# Altium project Remote Power Enable (RPE).PrjPcb
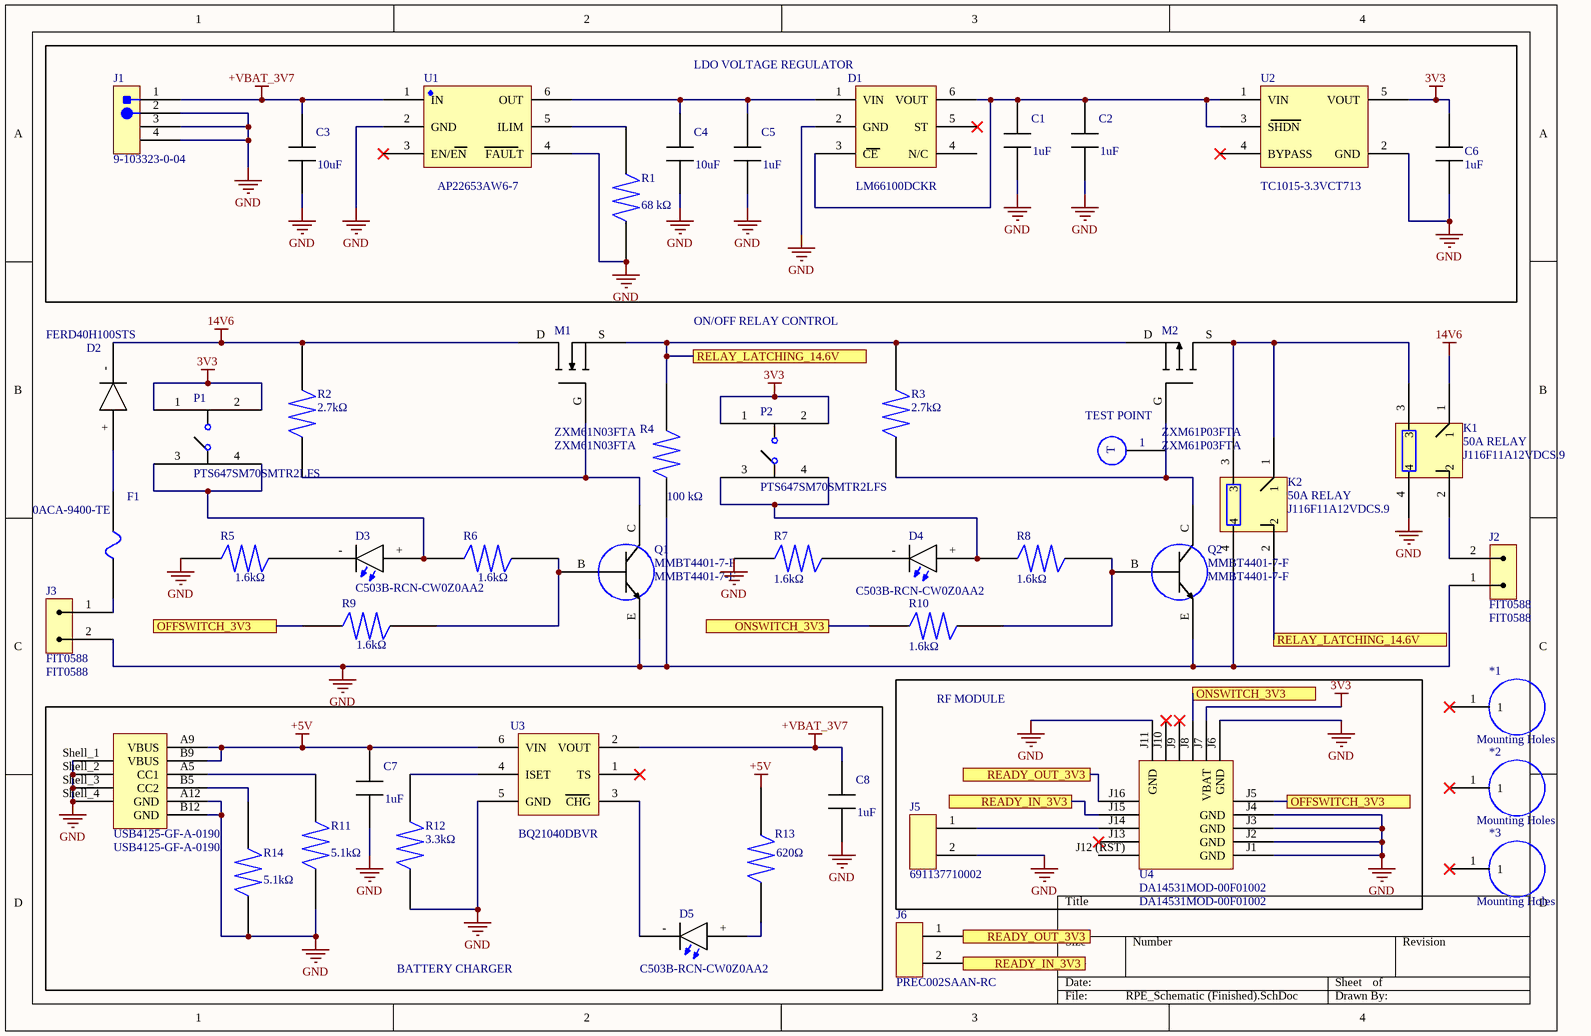
[diagram p0: RPE_Schematic (Finished).SchDoc]
1 sheet, 49 parts. Net scope: flat (ports and power ports of the same name join across sheets).
Board file: RPE_PCB.PcbDoc

## Sheet RPE_Schematic (Finished).SchDoc
size A4; SheetNumber: 1; SheetTotal: 1

### Parts
*1  Mounting Holes  [Mounting Holes]
*2  Mounting Holes  [Mounting Holes]
*3  Mounting Holes  [Mounting Holes]
C1  value 1uF  [CL10B105MO8NNWC]  (hidden comment: 1 uF Capacitor)
C2  value 1uF  [CL10B105MO8NNWC]  (hidden comment: 1 uF Capacitor)
C3  value 10uF  [GRM188D71A106MA73J]  (hidden comment: GRM188D71A106MA73J)
C4  value 10uF  [GRM188D71A106MA73J]  (hidden comment: GRM188D71A106MA73J)
C5  value 1uF  [CL10B105MO8NNWC]  (hidden comment: 1 uF Capacitor)
C6  value 1uF  [CL10B105MO8NNWC]  (hidden comment: 1 uF Capacitor)
C7  value 1uF  [CL10B105MO8NNWC]  (hidden comment: 1 uF Capacitor)
C8  value 1uF  [CL10B105MO8NNWC]  (hidden comment: 1 uF Capacitor)
D1  *  [LM66100DCKR]  (value not drawn)
D2  100V DIODE  [FERD40H100STS]  (value not drawn)
D3  RED THROUGH HOLE LED  [C503B-RCN-CW0Z0AA2]  (value not drawn)
D4  RED THROUGH HOLE LED  [C503B-RCN-CW0Z0AA2]  (value not drawn)
D5  RED THROUGH HOLE LED  [C503B-RCN-CW0Z0AA2]  (value not drawn)
F1  40A FUSE  [0ACA-9400-TE]  (value not drawn)
J1  9-103323-0-04  [9-103323-0-04]
J2  FIT0588  [FIT0588]
J3  FIT0588  [FIT0588]
J4  USB4125-GF-A-0190  [USB4125-GF-A]
J5  691137710002  [691137710002]
J6  PREC002SAAN-RC  [PREC002SAAN-RC]
K1  50A RELAY  [J116F11A12VDCS.9]
K2  50A RELAY  [J116F11A12VDCS.9]
M1  ZXM61N03FTA  [ZXM61N03FTA]
M2  ZXM61P03FTA  [ZXM61P03FTA]
P1  *  [PTS 647 SK50 SMTR2 LFS]  (value not drawn)
P2  *  [PTS 647 SK50 SMTR2 LFS]  (value not drawn)
Q1  MMBT4401-7-F  [MMBT4401-13-F]
Q2  MMBT4401-7-F  [MMBT4401-13-F]
R1  value 68 kΩ  [RMCF0603FT68K0]  (hidden comment: RMCF0603FT68K0)
R2  value 2.7kΩ  [CR0603-FX-2701ELF]  (hidden comment: CR0603-FX-2701ELF)
R3  value 2.7kΩ  [CR0603-FX-2701ELF]  (hidden comment: CR0603-FX-2701ELF)
R4  100 kΩ  [CR0603FB100KS1]
R5  value 1.6kΩ  [SG73P1JTTD1601F]  (hidden comment: SG73P1JTTD1601F)
R6  value 1.6kΩ  [SG73P1JTTD1601F]  (hidden comment: SG73P1JTTD1601F)
R7  value 1.6kΩ  [SG73P1JTTD1601F]  (hidden comment: SG73P1JTTD1601F)
R8  value 1.6kΩ  [SG73P1JTTD1601F]  (hidden comment: SG73P1JTTD1601F)
R9  value 1.6kΩ  [SG73P1JTTD1601F]  (hidden comment: SG73P1JTTD1601F)
R10  value 1.6kΩ  [SG73P1JTTD1601F]  (hidden comment: SG73P1JTTD1601F)
R11  value 5.1kΩ  [RC0603FR-075K1L]  (hidden comment: RC0603FR-075K1L)
R12  value 3.3kΩ  [RC0603JR-133K3L]  (hidden comment: Chip Resistor)
R13  value 620Ω  [RMCF0603FT620R]  (hidden comment: RMCF0603FT620R)
R14  value 5.1kΩ  [RC0603FR-075K1L]  (hidden comment: RC0603FR-075K1L)
U1  *  [AP22653AW6-7]  (value not drawn)
U2  *  [TC1015-3.3VCT713]  (value not drawn)
U3  BQ21040DBVR  [BQ21040DBVR]
U4  DA14531MOD-00F01002  [DA14531MOD_REN]

### Blocks framed on the sheet
LDO VOLTAGE REGULATOR: C1-C6 D1 J1 R1 U1 U2
BATTERY CHARGER: C7 C8 D5 J4 R11-R14 U3
RF MODULE: J5 U4

### Ports
OFFSWITCH_3V3, ONSWITCH_3V3, READY_IN_3V3, READY_OUT_3V3, RELAY_LATCHING_14.6V

### Nets
3V3: C6.2 P1.1 P1.2 P2.1 P2.2 U2.5(VOUT) U4.J7(VBAT)
14V6: D2.- K1.1 M1.D R2.2
+5V: C7.2 J4.A9(VBUS) J4.B9(VBUS) R13.2 U3.6(VIN)
+VBAT_3V7: C3.2 C8.2 J1.1 U1.1(IN) U3.2(VOUT)
GND: C1.1 C2.1 C3.1 C4.1 C5.1 C6.1 C7.1 C8.1 D1.2(GND) J1.2 J1.3 J1.4 J2.1 J3.2 J4.A12(GND) J4.B12(GND) J4.Shell_1 J4.Shell_2 J4.Shell_3 J4.Shell_4 J5.2 K1.4 K2.4 Q1.E Q2.E R1.1 R4.1 R5.1 R7.1 R11.1 R12.1 R14.1 U1.2(GND) U1.4(FAULT) U2.2(GND) U3.5(GND) U4.J1(GND) U4.J2(GND) U4.J3(GND) U4.J4(GND) U4.J6(GND) U4.J11(GND)
NetC1_2: C1.2 C2.2 D1.3(CE) D1.6(VOUT) U2.1(VIN) U2.3(SHDN)
NetC4_2: C4.2 C5.2 D1.1(VIN) U1.6(OUT)
NetD2_+: D2.+ F1.1
NetD3_+: D3.+ P1.3 P1.4 R6.1
NetD3_-: D3.- R5.2
NetD4_+: D4.+ P2.3 P2.4 R8.1
NetD4_-: D4.- R7.2
NetD5_+: D5.+ R13.1
NetD5_-: D5.- U3.3(CHG)
NetF1_2: F1.2 J3.1
NetJ2_2: J2.2 K1.2
NetJ4_A5: J4.A5(CC1) R11.2
NetJ4_B5: J4.B5(CC2) R14.2
NetJ5_1: J5.1 U4.J14
NetJ6_1: J6.1 U4.J16 ; port READY_OUT_3V3
NetJ6_2: J6.2 U4.J15 ; port READY_IN_3V3
NetK1_3: K1.3 K2.1 K2.3 M2.S
NetK2_2: K2.2 M1.S M2.D R3.2 R4.2 ; port RELAY_LATCHING_14.6V
NetM1_G: M1.G Q1.C R2.1
NetM2_G: M2.G Q2.C R3.1
NetQ1_B: Q1.B R6.2 R9.2
NetQ2_B: Q2.B R8.2 R10.2
NetR1_2: R1.2 U1.5(ILIM)
NetR9_1: R9.1 U4.J5 ; port OFFSWITCH_3V3
NetR10_1: R10.1 U4.J8 ; port ONSWITCH_3V3
NetR12_2: R12.2 U3.4(ISET)

Not connected (* = marked no-connect by the designer): *1 1*; *2 1*; *3 1*; D1 4(N/C) 5(ST)*; U1 3(EN/EN)*; U2 4(BYPASS)*; U3 1(TS)*; U4 J9* J10* J12 (RST) J13*

### Notes on the sheet
- ON/OFF RELAY CONTROL
- (near M2) TEST POINT
- T
- 1

### Library data of the parts
C1 C2 C5-C8 = CL10B105MO8NNWC: SMD Multilayer Ceramic Capacitor, 1 µF, 16 V, 0603 [1608 Metric], ± 20%, X7R, CL Series; Manufacturer: Samsung; Material: 4241ConductorMaterial; Voltage Rating: 16V; Dielectric: 1511DielectricType; Supplier: Digikey; Supplier Part Number: 1276-6524-1-ND; Manufacturer Part Number: CL10B105MO8NNWC; RoHS: Yes; Category: Ceramic Capacitors; Stock: 1284189; Pricing: 1=0.1, 10=0.034, 50=0.0196, 100=0.0152, 500=0.01142, 1000=0.00897 (USD); Mounting Technology: Surface Mount; Case/Package: 0603; Case Code (Metric): 1608; Case Code (Imperial): 0603; Min Operating Temperature: -55°C; Max Operating Temperature: 125°C; Packaging: Cut Tape; Tolerance: 20%; Series: CL; Voltage Rating (DC): 16V; Length: 0.063inch; Width: 0.031inch; Height: 900um; Thickness: 0.035inch; RoHS Compliant: Yes; ComponentLink1URL: https://media.digikey.com/pdf/Data%20Sheets/Samsung%20PDFs/CL10B105MO8NNWC.pdf?src-supplier=Digikey; ComponentLink1Description: https://media.digikey.com/pdf/Data%20Sheets/Samsung%20PDFs/CL10B105MO8NNWC.pdf?src-supplier=Digikey; ComponentLink2URL: http://www.farnell.com/datasheets/2710574.pdf?src-supplier=Farnell; ComponentLink2Description: http://www.farnell.com/datasheets/2710574.pdf?src-supplier=Farnell; ComponentLink3URL: https://datasheet.octopart.com/CL10B105MO8NNWC-Samsung-Electro-Mechanics-datasheet-120079234.pdf?src-supplier=Future+Electronics; ComponentLink3Description: https://datasheet.octopart.com/CL10B105MO8NNWC-Samsung-Electro-Mechanics-datasheet-120079234.pdf?src-supplier=Future+Electronics; ComponentLink4URL: http://www.farnell.com/datasheets/2710574.pdf?src-supplier=Newark; ComponentLink4Description: http://www.farnell.com/datasheets/2710574.pdf?src-supplier=Newark; ComponentLink5URL: http://www.farnell.com/datasheets/2710574.pdf?src-supplier=Element14; ComponentLink5Description: http://www.farnell.com/datasheets/2710574.pdf?src-supplier=Element14
C3 C4 = GRM188D71A106MA73J: Cap 10UF 10VDC X7T 20% SMD 0603 Paper Tape; Manufacturer: Murata; Voltage Rating: 10V; Supplier: Digikey; Supplier Part Number: 490-GRM188D71A106MA73JCT-ND; Manufacturer Part Number: GRM188D71A106MA73J; RoHS: Yes; Category: Ceramic Capacitors; Stock: 9799; Pricing: 1=0.3, 10=0.197, 50=0.145, 100=0.118, 500=0.09316, 1000=0.07867, 2500=0.07453, 5000=0.07039 (USD); Mounting Technology: Surface Mount; Case/Package: 0603; Weight: 0.000222oz; Min Operating Temperature: -55°C; Max Operating Temperature: 125°C; Packaging: Tape and Reel; Tolerance: 20%; Package Quantity: 10000; Dielectric: X7T; Voltage Rating (DC): 10V; Series: GRM; RoHS Compliant: Yes; ComponentLink1URL: http://www.mouser.com/ds/2/281/c02e-2905.pdf?src-supplier=Mouser; ComponentLink1Description: http://www.mouser.com/ds/2/281/c02e-2905.pdf?src-supplier=Mouser; ComponentLink2URL: http://search.murata.co.jp/Ceramy/image/img/A01X/partnumbering_e_01.pdf?src-supplier=Digikey; ComponentLink2Description: http://search.murata.co.jp/Ceramy/image/img/A01X/partnumbering_e_01.pdf?src-supplier=Digikey
D1 = LM66100DCKR: 1.5-V to 5.5-V, 1.5-A, 0.5-uA IQ ideal diode with Integrated FET 6-SC70 -40 to 105; Manufacturer: Texas Instruments; Max Output current: 1.5A; Turn-On Delay Time: 27us; Turn-Off Delay Time: 2us; Supplier: Digikey; Supplier Part Number: 296-53541-1-ND; RoHS: Yes; Category: Integrated Circuits (ICs); Stock: 1921; Pricing: 1=0.41, 10=0.332, 25=0.304, 100=0.2262, 250=0.20504, 500=0.16968, 1000=0.12726 (USD); Mounting Technology: Surface Mount; Min Operating Temperature: -40°C; Max Operating Temperature: 105°C; Series: -; ComponentLink1URL: http://www.ti.com/general/docs/suppproductinfo.tsp?distId=10&amp;gotoUrl=http%3A%2F%2Fwww.ti.com%2Flit%2Fgpn%2flm66100&src-supplier=Digikey; ComponentLink1Description: http://www.ti.com/general/docs/suppproductinfo.tsp?distId=10&amp;gotoUrl=http%3A%2F%2Fwww.ti.com%2Flit%2Fgpn%2flm66100&src-supplier=Digikey; Manufacturer Part Number: LM66100DCKR
D2 = FERD40H100STS: FERD40H100 Series 100 V 40 A Field Effect Rectifier Diode - TO-220AB; Manufacturer: STMicroelectronics; Average Rectified Current: 40A; Supplier: Digikey; Supplier Part Number: 497-16954-ND; RoHS: Yes; Category: Rectifier Diodes; Stock: 1657; Pricing: 1=1.4, 50=1.1266, 100=0.8927, 500=0.7567, 1000=0.61641, 2000=0.58028, 5000=0.55264, 10000=0.52714 (USD); Mounting Technology: Through Hole; Case/Package: TO-220-3; Packaging: Rail/Tube; Max Reverse Voltage (DC): 100V; Series: -; Diode Type: RECTIFIER; RoHS Compliant: Yes; ComponentLink1URL: http://www.st.com/content/ccc/resource/technical/document/datasheet/group3/4e/b5/b8/47/b6/af/41/d6/DM00281757/files/DM00281757.pdf/jcr:content/translations/en.DM00281757.pdf?src-supplier=Digikey; ComponentLink1Description: http://www.st.com/content/ccc/resource/technical/document/datasheet/group3/4e/b5/b8/47/b6/af/41/d6/DM00281757/files/DM00281757.pdf/jcr:content/translations/en.DM00281757.pdf?src-supplier=Digikey; ComponentLink2URL: https://datasheet.octopart.com/FERD40H100STS-STMicroelectronics-datasheet-62332851.pdf?src-supplier=Future+Electronics; ComponentLink2Description: https://datasheet.octopart.com/FERD40H100STS-STMicroelectronics-datasheet-62332851.pdf?src-supplier=Future+Electronics; ComponentLink3URL: https://datasheet.octopart.com/FERD40H100STS-STMicroelectronics-datasheet-141402762.pdf?src-supplier=TME; ComponentLink3Description: https://datasheet.octopart.com/FERD40H100STS-STMicroelectronics-datasheet-141402762.pdf?src-supplier=TME; Manufacturer Part Number: FERD40H100STS
D3-D5 = C503B-RCN-CW0Z0AA2: CREE - C503B-RCN-CW0Z0AA2 - LED, Red, Through Hole, T-1 3/4 (5mm), 20 mA, 2.1 V, 624 nm; Lens Color: Colorless; Luminous Intensity: 7500mcd; Viewing Angle: 30°; Forward Voltage: 2.1V; Wavelength: 624nm; Forward Current: 20mA; Lens Style: Dome,Elliptical,Round; Lens Transparency: Clear; Number of LEDs: 1; Supplier: Digikey; Supplier Part Number: C503B-RCN-CW0Z0AA2CT-ND; Manufacturer: Cree; RoHS: Yes; Category: LEDs; Stock: 49819; Pricing: 1=0.18, 10=0.167, 100=0.1548, 1000=0.139 (USD); Mounting Technology: Through Hole; Case/Package: Radial; Pins: 5; Color: Red; Min Operating Temperature: -40°C; Max Operating Temperature: 100°C; Illumination Color: Red; Package Quantity: 2500; Packaging: Cut Tape; Test Current: 20mA; Dominant Wavelength: 624nm; Series: -; Height: 10.3mm; RoHS Compliant: Yes; Reach SVHC Compliant: Unknown; ComponentLink1URL: https://datasheet.ciiva.com/8076/c503brasranaasaanrbsrbnabsabnrcsrcnacsacn1079-8076255.pdf?src-supplier=Element14; ComponentLink1Description: https://datasheet.ciiva.com/8076/c503brasranaasaanrbsrbnabsabnrcsrcnacsacn1079-8076255.pdf?src-supplier=Element14; ComponentLink2URL: https://datasheet.ciiva.com/46396/1783695-46396283.pdf?src-supplier=Element14; ComponentLink2Description: https://datasheet.ciiva.com/46396/1783695-46396283.pdf?src-supplier=Element14; ComponentLink3URL: https://datasheet.ciiva.com/2116/c503brasranaasaanrbsrbnabsabnrcsrcnacsacn1079-2116093.pdf?src-supplier=Digikey; ComponentLink3Description: https://datasheet.ciiva.com/2116/c503brasranaasaanrbsrbnabsabnrcsrcnacsacn1079-2116093.pdf?src-supplier=Digikey; Manufacturer Part Number: C503B-RCN-CW0Z0AA2
F1 = 0ACA-9400-TE: Bel Fuse, Internal Part #: 0ACA-9400-TE 40A FUSE; Supplier: Digikey; Supplier Part Number: 507-0ACA-9400-TECT-ND; Manufacturer: Bel; RoHS: Yes; Category: Fuses; Stock: 695; Pricing: 1=1.32, 5=1.282, 10=1.199, 50=0.9926, 100=0.8272, 250=0.80652, 500=0.68244 (USD); Manufacturer Part Number: 0ACA-9400-TE
J1 = 9-103323-0-04: CONN HEADR BRKWAY .100 04POS R/A 4 PIN HEADER; Manufacturer: TE Connectivity; Number of Positions: 4; Gender: Male; Supplier: Digikey; Supplier Part Number: A32705-04-ND; RoHS: Yes; Category: Connectors; Stock: 9773; Pricing: 1=0.69, 10=0.672, 100=0.5422, 500=0.4801, 1000=0.4208, 5000=0.36714, 10000=0.34172 (USD); Mounting Technology: Through Hole; Case/Package: 100; Housing Color: Black; Contact Material: Copper Alloy; Housing Material: Plastic; Contact Shape: Square; Contact Finish - Mating: TIN; Insulation Material: Thermoplastic; Insulation Color: Black; Min Operating Temperature: -65°C; Max Operating Temperature: 105°C; Number of Rows: 1; Packaging: Bulk; Termination: Solder; Number of Contacts: 4; Series: AMPMODU MOD II; Contact Type: Male Pin; Fastening Type: Pull; Length: 9.75mm; Width: 2.29mm; Height: 3.5mm; Lead Free: Lead Free; Flammability Rating: UL94 V-0; ComponentLink1URL: http://www.te.com/commerce/DocumentDelivery/DDEController?Action=srchrtrv&DocNm=103323&DocType=Customer+Drawing&DocLang=English&src-supplier=Digikey; ComponentLink1Description: http://www.te.com/commerce/DocumentDelivery/DDEController?Action=srchrtrv&DocNm=103323&DocType=Customer+Drawing&DocLang=English&src-supplier=Digikey; Manufacturer Part Number: 9-103323-0-04
J2 J3 = FIT0588: High Quality Gold Plated Male and Female Bullet Connector; Manufacturer: DFRobot; Supplier: Digikey; Supplier Part Number: 1738-1438-ND; RoHS: No; Category: LDO; Stock: 1280; Pricing: 1=3.9 (USD); ComponentLink1URL: https://media.digikey.com/pdf/Data%20Sheets/DFRobot%20PDFs/FIT0588_Web.pdf?src-supplier=Digikey; ComponentLink1Description: https://media.digikey.com/pdf/Data%20Sheets/DFRobot%20PDFs/FIT0588_Web.pdf?src-supplier=Digikey; Manufacturer Part Number: FIT0588
J4 = USB4125-GF-A-0190: USB Connector, 24 Contact(s), Female, Right Angle, Solder Terminal, Locking, Receptacle; Manufacturer: Global Connector Technology; USB Standard: 6108USBStandard; Current Rating: 3A; Number of Contacts: 6NUMBER; Voltage Rating: 20V; Supplier: Newark; Supplier Part Number: 56AJ0230; RoHS: No; Category: USB Connectors; Stock: 2157; Pricing: 1=0.379, 50=0.379, 100=0.347, 250=0.347, 500=0.32, 1000=0.32, 1500=0.32, 3000=0.298 (USD); Contact Material: 157ConductorMaterial; Min Operating Temperature: -30°C; Max Operating Temperature: 85°C; Height: 3.41mm; Manufacturer Part Number: USB4125-GF-A-0190
J5 = 691137710002: Series 1377 - 5.00 mm Horizontal Entry with Pressure Clamp WR-TBL, 2 pin; Manufacturer: Wurth Electronics; Plating: Copper Alloy,ZINC PLATED; Number of Levels: 1; Number of Positions Per Level: 2; Current: 16A; Voltage: 300V; Number of Contacts: 2NUMBER; Wire Gauge (Max): 30AWG; Wire Gauge (Min): 12AWG; Supplier: Digikey; Supplier Part Number: 732-10955-ND; RoHS: Yes; Category: Terminal Blocks; Stock: 5754; Pricing: 1=0.41, 10=0.363, 50=0.32, 100=0.287, 500=0.277 (USD); Mounting Technology: Through Hole; Pins: 2NUMBER; Color: Green; Housing Material: PC; Contact Material: 153,154ConductorMaterial; Min Operating Temperature: -30°C; Max Operating Temperature: 120°C; Termination: Screw; Series: WR-TBL Series 1377; Current Rating: 16A; Number of Rows: 1NUMBER; Voltage Rating: 300V; Height: 11.6mm; Lead Pitch: 5mm; RoHS Compliant: Yes; ComponentLink1URL: https://katalog.we-online.de/em/datasheet/691137710002.pdf?src-supplier=Digikey; ComponentLink1Description: https://katalog.we-online.de/em/datasheet/691137710002.pdf?src-supplier=Digikey; Manufacturer Part Number: 691137710002
J6 = PREC002SAAN-RC: CONN HEADER VERT 2POS 2.54MM
K1 K2 = J116F11A12VDCS.9: Relay Gen Purpose SPST 50A 12V; Manufacturer: CIT Relay & Switch; Supplier: Digikey; Supplier Part Number: 2449-J116F11A12VDCS.9-ND; RoHS: No; Category: Power Relays; Stock: 434; Pricing: 1=3.35, 15=3.136, 30=2.78767, 60=2.64817, 105=2.50886, 255=2.23008, 510=2.09071, 1005=1.95132, 5010=1.88163 (USD); Manufacturer Part Number: J116F11A12VDCS.9
M1 = ZXM61N03FTA: N-Channel 30V 1.4A (Ta) 625mW (Ta) Surface Mount SOT-23-3; Manufacturer: Diodes Zetex; Rise Time: 2.5ns; Gate to Source Voltage (Vgs): 20V; Turn-Off Delay Time: 5.8ns; Turn-On Delay Time: 1.9ns; Rds On Max: 220mR; Input Capacitance: 150pF; Nominal Vgs: 1V; Number of Elements: 1; Power Dissipation: 806mW; Current Rating: 1.2A; Supplier: Digikey; Supplier Part Number: ZXM61N03FCT-ND; RoHS: Yes; Category: MOSFETs; Stock: 146742; Pricing: 1=0.46, 10=0.397, 100=0.2757, 500=0.21528, 1000=0.17498 (USD); Mounting Technology: Surface Mount; Case/Package: SOT-23; Pins: 3; Weight: 0.000282oz; Min Operating Temperature: -55°C; Max Operating Temperature: 150°C; Fall Time: 2.5ns; Package Quantity: 3000; Packaging: Tape and Reel; Max Power Dissipation: 625mW; Dual Supply Voltage: 30V; Drain to Source Voltage (Vdss): 30V; Continuous Drain Current (ID): 1.4A; Number of Channels: 1; Drain to Source Resistance: 220mR; Termination: SMD/SMT; Voltage Rating (DC): 30V; Polarity: N-CHANNEL; Series: -; Drain-source On Resistance-Max: 220mR; Length: 3.04mm; Width: 1.4mm; Height: 1.02mm; Radiation Hardening: No; Reach SVHC Compliant: No; Lead Free: Lead Free; RoHS Compliant: Yes; ComponentLink1URL: https://datasheet.ciiva.com/11176/zxm61n03f-11176547.pdf?src-supplier=Avnet; ComponentLink1Description: https://datasheet.ciiva.com/11176/zxm61n03f-11176547.pdf?src-supplier=Avnet; ComponentLink2URL: https://datasheet.ciiva.com/935/zxm61n03f-935122.pdf?src-supplier=Digikey; ComponentLink2Description: https://datasheet.ciiva.com/935/zxm61n03f-935122.pdf?src-supplier=Digikey; ComponentLink3URL: https://datasheet.ciiva.com/5775/1643170-5775147.pdf?src-supplier=Farnell; ComponentLink3Description: https://datasheet.ciiva.com/5775/1643170-5775147.pdf?src-supplier=Farnell; ComponentLink4URL: https://datasheet.ciiva.com/935/zxm61n03f-935123.pdf?src-supplier=Digikey; ComponentLink4Description: https://datasheet.ciiva.com/935/zxm61n03f-935123.pdf?src-supplier=Digikey; ComponentLink5URL: https://datasheet.ciiva.com/935/zxm61n03f-935124.pdf?src-supplier=Digikey; ComponentLink5Description: https://datasheet.ciiva.com/935/zxm61n03f-935124.pdf?src-supplier=Digikey; ComponentLink6URL: https://datasheet.ciiva.com/8024/1643170-8024088.pdf?src-supplier=Element14; ComponentLink6Description: https://datasheet.ciiva.com/8024/1643170-8024088.pdf?src-supplier=Element14; Manufacturer Part Number: ZXM61N03FTA
M2 = ZXM61P03FTA: ZXM61P03F 30 V 0.35 Ohm P-Channel Enhancement Mode Vertical DMOS FET - SOT-23; Manufacturer: Diodes Zetex; Rise Time: 2.9ns; Gate to Source Voltage (Vgs): 20V; Turn-Off Delay Time: 8.9ns; Turn-On Delay Time: 1.9ns; Nominal Vgs: -1V; Max Power Dissipation: 625mW; Rds On Max: 350mR; Input Capacitance: 140pF; Number of Elements: 1; Dual Supply Voltage: -30V; Drain to Source Voltage (Vdss): 30V; Continuous Drain Current (ID): 1.1A; Drain to Source Resistance: 550mR; Power Dissipation: 806mW; Current Rating: -1.1A; Supplier: Digikey; Supplier Part Number: ZXM61P03FCT-ND; RoHS: Yes; Category: MOSFETs; Stock: 104868; Pricing: 1=0.42, 10=0.357, 100=0.2482, 500=0.19376, 1000=0.15748 (USD); Mounting Technology: Surface Mount; Case/Package: SOT-23; Pins: 3; Weight: 0.000282oz; Min Operating Temperature: -55°C; Max Operating Temperature: 150°C; Fall Time: 2.9ns; Packaging: Tape and Reel; Package Quantity: 3000; Number of Channels: 1; Termination: SMD/SMT; Voltage Rating (DC): -30V; Polarity: P-CHANNEL; Series: -; Drain-source On Resistance-Max: 350mR; Length: 3.04mm; Width: 1.4mm; Height: 1.02mm; Radiation Hardening: No; Reach SVHC Compliant: No; Lead Free: Lead Free; RoHS Compliant: Yes; ComponentLink1URL: https://datasheet.ciiva.com/11176/zxm61p03f-11176401.pdf?src-supplier=Avnet; ComponentLink1Description: https://datasheet.ciiva.com/11176/zxm61p03f-11176401.pdf?src-supplier=Avnet; ComponentLink2URL: https://datasheet.ciiva.com/11176/zxm61p03f-11176557.pdf?src-supplier=Avnet; ComponentLink2Description: https://datasheet.ciiva.com/11176/zxm61p03f-11176557.pdf?src-supplier=Avnet; ComponentLink3URL: https://datasheet.ciiva.com/935/zxm61p03f-935140.pdf?src-supplier=Digikey; ComponentLink3Description: https://datasheet.ciiva.com/935/zxm61p03f-935140.pdf?src-supplier=Digikey; ComponentLink4URL: https://datasheet.ciiva.com/935/zxm61p03f-935141.pdf?src-supplier=Digikey; ComponentLink4Description: https://datasheet.ciiva.com/935/zxm61p03f-935141.pdf?src-supplier=Digikey; ComponentLink5URL: https://datasheet.ciiva.com/935/zxm61p03f-935142.pdf?src-supplier=Digikey; ComponentLink5Description: https://datasheet.ciiva.com/935/zxm61p03f-935142.pdf?src-supplier=Digikey; ComponentLink6URL: https://datasheet.ciiva.com/4443/zxm61p03f-4443147.pdf?src-supplier=Mouser; ComponentLink6Description: https://datasheet.ciiva.com/4443/zxm61p03f-4443147.pdf?src-supplier=Mouser; ComponentLink7URL: https://datasheet.ciiva.com/16216/zxm61p03f-16216056.pdf?src-supplier=Future+Electronics; ComponentLink7Description: https://datasheet.ciiva.com/16216/zxm61p03f-16216056.pdf?src-supplier=Future+Electronics; Manufacturer Part Number: ZXM61P03FTA
P1 P2 = PTS647SM70SMTR2LFS: Switch Tactile N.O. SPST Round Button Gull Wing 0.05A 12VDC 100000Cycles 1.77N SMD T/R; Manufacturer: ITT C&K; Illumination Type: Non-Illuminated; Switch Function: Off-Mom; Actuator Type: Standard; Operating Force: 180gf; Switch Travel: 0.25mm; Ratings: IP40; Supplier: Digikey; Supplier Part Number: PTS647SM70SMTR2LFSCT-ND; RoHS: No; Category: Tactile Switches; Stock: 62901; Pricing: 1=0.26, 10=0.249, 25=0.236, 100=0.2138, 250=0.19488, 500=0.18114 (USD); Mounting Technology: Surface Mount; Mechanical Life: 100000Cycles; Min Operating Temperature: -20°C; Max Operating Temperature: 70°C; Throw Configuration: SPST; Packaging: Cut Tape; Termination: Gull Wing; Series: PTS647; ComponentLink1URL: https://www.ckswitches.com/media/2567/pts647.pdf?src-supplier=Digikey; ComponentLink1Description: https://www.ckswitches.com/media/2567/pts647.pdf?src-supplier=Digikey; Manufacturer Part Number: PTS647SM70SMTR2LFS
Q1 Q2 = MMBT4401-7-F: Bipolar Transistors - 40V NPN SMALL SIGNAL TRANSISTOR IN SOT23 package; Manufacturer: Diodes Zetex; Max Power Dissipation: 310mW; Frequency: 250MHz; Max Collector Current: 600mA; Collector Base Voltage (VCBO): 60V; Number of Elements: 1; Emitter Base Voltage (VEBO): 6V; Collector-emitter Voltage-Max: 750mV; Supplier: Digikey; Supplier Part Number: MMBT4401-7-F-ND; RoHS: Yes; Category: BJTs; Pricing: 10000=0.01919, 30000=0.01775, 50000=0.01535, 100000=0.01439, 250000=0.01276 (USD); Mounting Technology: Surface Mount; Case/Package: SOT-23; Pins: 3; Min Operating Temperature: -55°C; Max Operating Temperature: 150°C; Packaging: Tape and Reel; Collector Emitter Voltage (VCEO): 40V; Transition Frequency: 250MHz; Polarity: NPN; Power Dissipation: 310mW; Collector Emitter Breakdown Voltage: 40V; Series: Automotive, AEC-Q101; Clock Frequency: 250MHz; Radiation Hardening: No; Reach SVHC Compliant: No; RoHS Compliant: Yes; ComponentLink1URL: https://datasheet.ciiva.com/15139/getdatasheetpartid-234007-15139792.pdf?src-supplier=Verical; ComponentLink1Description: https://datasheet.ciiva.com/15139/getdatasheetpartid-234007-15139792.pdf?src-supplier=Verical; Manufacturer Part Number: MMBT4401-7-F
R1 = RMCF0603FT68K0: Res Thick Film 0603 68K Ohm 1% 0.1W(1/10W) ±100ppm/C Pad SMD T/R Automotive AEC-Q200; Manufacturer: Stackpole Electronics; Max Power Dissipation: 100mW; Temperature Coefficient: 100ppm/°C; Voltage Rating: 75V; Supplier: Digikey; Supplier Part Number: RMCF0603FT68K0CT-ND; Manufacturer Part Number: RMCF0603FT68K0; RoHS: Yes; Category: Chip SMD Resistors; Stock: 195427; Pricing: 1=0.1, 10=0.015, 50=0.009, 100=0.0075, 500=0.00498, 1000=0.00425 (USD); Mounting Technology: Surface Mount; Case/Package: 0603; Case Code (Metric): 1608; Case Code (Imperial): 0603; Contact Plating: Tin,Matte; Min Operating Temperature: -55°C; Max Operating Temperature: 155°C; Packaging: Tape and Reel; Tolerance: 1%; Package Quantity: 5000; Number of Terminations: 2; Features: Automotive AEC-Q200; Series: RMCF; Construction: Rectangular; Length: 0.061inch; Width: 0.031inch; Height: 0.022inch; Depth: 0.8mm; Radiation Hardening: No; Military Standard: Not; RoHS Compliant: Yes; ComponentLink1URL: http://components.arrow.com/part/dataview/50507743S112918N1174?src-supplier=Arrow+Electronics; ComponentLink1Description: http://components.arrow.com/part/dataview/50507743S112918N1174?src-supplier=Arrow+Electronics; ComponentLink2URL: https://www.seielect.com/catalog/SEI-Packaging.pdf?src-supplier=Digikey; ComponentLink2Description: https://www.seielect.com/catalog/SEI-Packaging.pdf?src-supplier=Digikey; ComponentLink3URL: https://www.seielect.com/catalog/SEI-RMCF_RMCP.pdf?src-supplier=Avnet; ComponentLink3Description: https://www.seielect.com/catalog/SEI-RMCF_RMCP.pdf?src-supplier=Avnet
R2 R3 = CR0603-FX-2701ELF: SMD Chip Resistor, 2.7 kOhm, ± 1%, 100 mW, 0603 [1608 Metric], Thick Film, General Purpose; Manufacturer: Bourns; Power Rating: 100mW; Voltage Rating: 50V; Temperature Coefficient: 100ppm/°C; Supplier: Digikey; Supplier Part Number: CR0603-FX-2701ELFCT-ND; Manufacturer Part Number: CR0603-FX-2701ELF; RoHS: Yes; Category: Chip SMD Resistors; Stock: 96883; Pricing: 1=0.1, 10=0.015, 50=0.009, 100=0.0075, 500=0.00498, 1000=0.00425 (USD); Mounting Technology: Surface Mount; Case/Package: 0603; Case Code (Imperial): 0603; Case Code (Metric): 1608; Contact Plating: Tin; Min Operating Temperature: -55°C; Max Operating Temperature: 155°C; Tolerance: 1%; Packaging: Tape and Reel; Package Quantity: 5000; Termination: SMD/SMT; Number of Terminations: 2; Max Power Dissipation: 100mW; Features: Moisture Resistant; Series: CR0603; Voltage Rating (DC): 50V; Length: 0.063inch; Width: 0.031inch; Height: 0.022inch; Thickness: 457um; Radiation Hardening: No; RoHS Compliant: Yes; ComponentLink1URL: https://datasheet.ciiva.com/18607/chpreztr-18607957.pdf?src-supplier=Digikey; ComponentLink1Description: https://datasheet.ciiva.com/18607/chpreztr-18607957.pdf?src-supplier=Digikey
R4 = CR0603FB100KS1: 100 kΩ Resistor
R5-R10 = SG73P1JTTD1601F: Res, 1K6, 1%, 0.2W, 0603 Rohs Compliant: Yes; Manufacturer: KOA Speer; Power Rating: 200mW; Voltage Rating: 50V; Temperature Coefficient: 100ppm/°C; Supplier: Digikey; Supplier Part Number: 2019-SG73P1JTTD1601FTR-ND; Manufacturer Part Number: SG73P1JTTD1601F; RoHS: Yes; Category: Chip SMD Resistors; Pricing: 5000=0.01791 (USD); Case/Package: 0603; Pins: 2; Case Code (Imperial): 0603; Case Code (Metric): 1608; Min Operating Temperature: -55°C; Max Operating Temperature: 155°C; Packaging: Tape and Reel; Package Quantity: 5000; Tolerance: 1%; Voltage Rating (DC): 50V; Resistor Type: Thick Film; Termination: SMD/SMT; Series: SG73; Resistance Tolerance: 1%; Length: 1.6mm; Width: 0.8mm; Height: 0.45mm; RoHS Compliant: Yes; Reach SVHC Compliant: Unknown; ComponentLink1URL: https://datasheet.ciiva.com/22640/78338-22640856.pdf?src-supplier=Farnell; ComponentLink1Description: https://datasheet.ciiva.com/22640/78338-22640856.pdf?src-supplier=Farnell
R11 R14 = RC0603FR-075K1L: SMD Chip Resistor, 5.1 kOhm, ± 1%, 100 mW, 0603 [1608 Metric], Thick Film, General Purpose; Manufacturer: Yageo; Power Rating: 100mW; Temperature Coefficient: 100ppm/°C; Voltage Rating: 50V; Supplier: Digikey; Supplier Part Number: 311-5.10KHRCT-ND; Manufacturer Part Number: RC0603FR-075K1L; RoHS: Yes; Category: Chip SMD Resistors; Stock: 2462904; Pricing: 1=0.1, 10=0.019, 50=0.0112, 100=0.0093, 500=0.00622, 1000=0.00532 (USD); Case/Package: 0603; Pins: 2NUMBER; Case Code (Imperial): 0603; Case Code (Metric): 1608; Min Operating Temperature: -55°C; Max Operating Temperature: 155°C; Tolerance: 1%; Series: RC; Packaging: Tape and Reel; Package Quantity: 1; Termination: SMD/SMT; Resistor Type: Thick Film; Number of Terminations: 2; Max Power Dissipation: 100mW; Features: Moisture Resistant; Resistance Tolerance: 1%; Construction: Rectangular; Voltage Rating (DC): 50V; Length: 0.063inch; Width: 0.031inch; Height: 0.022inch; Depth: 0.8mm; RoHS Compliant: Yes; Reach SVHC Compliant: No; Military Standard: Not; Lead Free: 5697LeadFree; ComponentLink1URL: https://datasheet.ciiva.com/46395/443971-46395016.pdf?src-supplier=Element14; ComponentLink1Description: https://datasheet.ciiva.com/46395/443971-46395016.pdf?src-supplier=Element14; ComponentLink2URL: https://datasheet.ciiva.com/2454/pyu-r-int-thick-7-2454046.pdf?src-supplier=Digikey; ComponentLink2Description: https://datasheet.ciiva.com/2454/pyu-r-int-thick-7-2454046.pdf?src-supplier=Digikey; ComponentLink3URL: https://datasheet.ciiva.com/2454/pyu-r-int-thick-7-2454047.pdf?src-supplier=Digikey; ComponentLink3Description: https://datasheet.ciiva.com/2454/pyu-r-int-thick-7-2454047.pdf?src-supplier=Digikey; ComponentLink4URL: https://datasheet.ciiva.com/2454/pyu-r-int-thick-7-2454045.pdf?src-supplier=Digikey; ComponentLink4Description: https://datasheet.ciiva.com/2454/pyu-r-int-thick-7-2454045.pdf?src-supplier=Digikey; ComponentLink5URL: https://datasheet.ciiva.com/15189/getdatasheetpartid-326732-15189786.pdf?src-supplier=Verical; ComponentLink5Description: https://datasheet.ciiva.com/15189/getdatasheetpartid-326732-15189786.pdf?src-supplier=Verical
R12 = RC0603FR-133K3L: SMD Chip Resistor, 3.3 kOhm, ± 1%, 100 mW, 0603 [1608 Metric], Thick Film, General Purpose; Manufacturer: Yageo; Voltage Rating: 50V; Power Rating: 100mW; Temperature Coefficient: 100ppm/°C; Supplier: Digikey; Supplier Part Number: 13-RC0603FR-133K3LCT-ND; Manufacturer Part Number: RC0603FR-133K3L; RoHS: Yes; Category: Chip SMD Resistors; Stock: 52269; Pricing: 1=0.1, 10=0.019, 50=0.0114, 100=0.0094, 500=0.00628, 1000=0.00536, 5000=0.00385, 10000=0.00337 (USD); Case/Package: 0603; Case Code (Imperial): 0603; Case Code (Metric): 1608; Min Operating Temperature: -55°C; Max Operating Temperature: 155°C; Termination: SMD/SMT; Series: RC; Packaging: Tape and Reel; Tolerance: 1%; Length: 1.6mm; Width: 0.8mm; Height: 0.45mm; RoHS Compliant: Yes; Lead Free: 5697LeadFree; ComponentLink1URL: http://www.mouser.com/ds/2/447/RC0603-272842.pdf?src-supplier=Mouser; ComponentLink1Description: http://www.mouser.com/ds/2/447/RC0603-272842.pdf?src-supplier=Mouser; ComponentLink2URL: https://datasheet.octopart.com/RC0603FR-133K3L-Yageo-datasheet-164759695.pdf?src-supplier=Future+Electronics; ComponentLink2Description: https://datasheet.octopart.com/RC0603FR-133K3L-Yageo-datasheet-164759695.pdf?src-supplier=Future+Electronics
R13 = RMCF0603FT620R: Res Thick Film 0603 620 Ohm 1% 1/10W ±100ppm/°C Molded SMD SMD Paper T/R; Manufacturer: Stackpole Electronics; Max Power Dissipation: 100mW; Voltage Rating: 75V; Supplier: Digikey; Supplier Part Number: RMCF0603FT620RCT-ND; Manufacturer Part Number: RMCF0603FT620R; RoHS: Yes; Category: Chip SMD Resistors; Stock: 43996; Pricing: 1=0.1, 10=0.015, 50=0.009, 100=0.0075, 500=0.00498, 1000=0.00425 (USD); Mounting Technology: Surface Mount; Case/Package: 0603; Case Code (Metric): 1608; Case Code (Imperial): 0603; Contact Plating: Tin,Matte; Min Operating Temperature: -55°C; Max Operating Temperature: 155°C; Packaging: Tape and Reel; Tolerance: 1%; Number of Terminations: 2; Temperature Coefficient: 100ppm/°C; Features: Automotive AEC-Q200; Series: RMCF; Length: 0.061inch; Width: 0.031inch; Height: 0.022inch; Ratings: AEC-Q200; Radiation Hardening: No; Lead Free: Lead Free; RoHS Compliant: Yes; ComponentLink1URL: https://www.seielect.com/Catalog/SEI-RMCF_RMCP.pdf?src-supplier=Digikey; ComponentLink1Description: https://www.seielect.com/Catalog/SEI-RMCF_RMCP.pdf?src-supplier=Digikey; ComponentLink2URL: https://www.seielect.com/catalog/SEI-Packaging.pdf?src-supplier=Digikey; ComponentLink2Description: https://www.seielect.com/catalog/SEI-Packaging.pdf?src-supplier=Digikey; ComponentLink3URL: https://www.seielect.com/catalog/SEI-RMCF_RMCP.pdf?src-supplier=Avnet; ComponentLink3Description: https://www.seielect.com/catalog/SEI-RMCF_RMCP.pdf?src-supplier=Avnet
U1 = AP22653AW6-7: PRECISION ADJUSTABLE CURRENT-LIMITED POWER SWITCHES, -40 to 85°C pF, RoHS; Manufacturer: Diodes; Number of Channels: 1NUMBER; Supplier: Digikey; Supplier Part Number: 31-AP22653AW6-7CT-ND; RoHS: Yes; Category: USB Interface ICs; Stock: 404154; Pricing: 1=0.44, 10=0.378, 25=0.3524, 100=0.282, 250=0.2618, 500=0.22154, 1000=0.17118 (USD); ComponentLink1URL: https://www.diodes.com/assets/Datasheets/AP22652_53_52A_53A.pdf?src-supplier=Digikey; ComponentLink1Description: https://www.diodes.com/assets/Datasheets/AP22652_53_52A_53A.pdf?src-supplier=Digikey; Manufacturer Part Number: AP22653AW6-7
U2 = TC1015-3.3VCT713: TC1015 Series 100 mA 3.3 V Fixed Output LDO Regulator w/ Shutdown - SOT-23-5; Manufacturer: Microchip; Min Input Voltage: 2.7V; Max Supply Voltage: 6V; Output Voltage: 3.3V; Number of Outputs: 1; Polarity: Positive; Accuracy: 2.5%; Max Output current: 100mA; Dropout Voltage: 180mV; Quiescent Current: 80uA; Power Supply Rejection Ratio (PSRR): 64dB; Number of Channels: 1NUMBER; Supplier: Digikey; Supplier Part Number: TC1015-3.3VCT713CT-ND; RoHS: Yes; Category: Voltage Regulators - Linear; Stock: 23325; Pricing: 1=0.49, 25=0.41, 100=0.36 (USD); Mounting Technology: Surface Mount; Case/Package: SOT-23; Pins: 5; Min Operating Temperature: -40°C; Max Operating Temperature: 125°C; Packaging: Tape and Reel; Output Type: Fixed; Series: -; Package Quantity: 3000; Output Current: 100mA; Number of Regulators: 1; Termination: SMD/SMT; Current Rating: 100mA; Min Supply Voltage: 2.7V; Nominal Output Voltage: 3.3V; Min Output Voltage: 3.3V; Max Output Voltage: 3.3V; Output Configuration: Positive; Length: 3.1mm; Width: 1.8mm; Height: 1.3mm; Radiation Hardening: No; RoHS Compliant: Yes; Reach SVHC Compliant: No; Lead Free: Lead Free; ComponentLink1URL: https://datasheet.ciiva.com/41463/001085540-da-01-en-ic-reg-ldo-tc1015-3-3vct713-sot-23-5-mcp-41463228.pdf?src-supplier=Conrad; ComponentLink1Description: https://datasheet.ciiva.com/41463/001085540-da-01-en-ic-reg-ldo-tc1015-3-3vct713-sot-23-5-mcp-41463228.pdf?src-supplier=Conrad; ComponentLink2URL: https://datasheet.ciiva.com/8238/jp011417-8238485.pdf?src-supplier=Avnet; ComponentLink2Description: https://datasheet.ciiva.com/8238/jp011417-8238485.pdf?src-supplier=Avnet; ComponentLink3URL: https://datasheet.ciiva.com/2040/filehandler-aspxddocname-en026002-2040022.pdf?src-supplier=Digikey; ComponentLink3Description: https://datasheet.ciiva.com/2040/filehandler-aspxddocname-en026002-2040022.pdf?src-supplier=Digikey; ComponentLink4URL: https://datasheet.ciiva.com/2040/filehandler-aspxddocname-en026002-2040023.pdf?src-supplier=Digikey; ComponentLink4Description: https://datasheet.ciiva.com/2040/filehandler-aspxddocname-en026002-2040023.pdf?src-supplier=Digikey; ComponentLink5URL: https://datasheet.ciiva.com/2040/filehandler-aspxddocname-en026002-2040024.pdf?src-supplier=Digikey; ComponentLink5Description: https://datasheet.ciiva.com/2040/filehandler-aspxddocname-en026002-2040024.pdf?src-supplier=Digikey; ComponentLink6URL: https://datasheet.ciiva.com/2075/21335e-2075754.pdf?src-supplier=Digikey; ComponentLink6Description: https://datasheet.ciiva.com/2075/21335e-2075754.pdf?src-supplier=Digikey; ComponentLink7URL: https://datasheet.ciiva.com/14562/70046349-14562758.pdf?src-supplier=Allied+Electronics; ComponentLink7Description: https://datasheet.ciiva.com/14562/70046349-14562758.pdf?src-supplier=Allied+Electronics; ComponentLink8URL: https://datasheet.ciiva.com/22711/82112-22711035.pdf?src-supplier=Element14; ComponentLink8Description: https://datasheet.ciiva.com/22711/82112-22711035.pdf?src-supplier=Element14; ComponentLink9URL: https://datasheet.ciiva.com/8041/21335e-8041544.pdf?src-supplier=Element14; ComponentLink9Description: https://datasheet.ciiva.com/8041/21335e-8041544.pdf?src-supplier=Element14; Manufacturer Part Number: TC1015-3.3VCT713
U3 = BQ21040DBVR: IC BAT CHG LI-ION 1 CELL SOT23-6 BATTERY CHARGER; Manufacturer: Texas Instruments; Number of Cells: 1; Fault Protection: Over Voltage,Over Temperature,Short Circuit; Interface: USB; Max Charge Current: 800mA; Battery Pack Voltage: 4.2V; Max Supply Voltage: 6.45V; Supplier: Digikey; Supplier Part Number: 296-47315-6-ND; RoHS: Yes; Category: Battery Management; Stock: 1140; Pricing: 1=0.89, 10=0.78, 25=0.7328, 100=0.5979, 250=0.5554, 500=0.47268, 1000=0.37814 (USD); Mounting Technology: Surface Mount; Case/Package: SOT-23-6; Min Operating Temperature: 0°C; Max Operating Temperature: 125°C; Packaging: Cut Tape; Series: -; Lead Free: Lead Free; RoHS Compliant: Yes; ComponentLink1URL: http://www.ti.com/lit/ds/symlink/bq21040.pdf?src-supplier=Digikey; ComponentLink1Description: http://www.ti.com/lit/ds/symlink/bq21040.pdf?src-supplier=Digikey; ComponentLink2URL: http://www.ti.com/general/docs/suppproductinfo.tsp?distId=10&gotoUrl=http%3A%2F%2Fwww.ti.com%2Flit%2Fgpn%2Fbq21040&src-supplier=Digikey; ComponentLink2Description: http://www.ti.com/general/docs/suppproductinfo.tsp?distId=10&gotoUrl=http%3A%2F%2Fwww.ti.com%2Flit%2Fgpn%2Fbq21040&src-supplier=Digikey; ComponentLink3URL: http://www.ti.com/general/docs/suppproductinfo.tsp?distId=10&amp;gotoUrl=http%3A%2F%2Fwww.ti.com%2Flit%2Fgpn%2Fbq21040&src-supplier=Digikey; ComponentLink3Description: http://www.ti.com/general/docs/suppproductinfo.tsp?distId=10&amp;gotoUrl=http%3A%2F%2Fwww.ti.com%2Flit%2Fgpn%2Fbq21040&src-supplier=Digikey; Manufacturer Part Number: BQ21040DBVR
U4 = DA14531MOD-00F01002: Bluetooth Module, 1MBPS, Bluetooth 5.1 Rohs Compliant: Yes; Manufacturer: Renesas; Supplier: Digikey; Supplier Part Number: 1695-DA14531MOD-00F01002CT-ND; RoHS: No; Category: RF Receivers, Transceivers; Stock: 218621; Pricing: 1=5.66, 10=5.05, 25=4.5448, 100=4.141, 250=3.737, 500=3.3532 (USD); ComponentLink1URL: https://datasheet.octopart.com/DA14531MOD-00F01002-Dialog-Semiconductor-datasheet-153441348.pdf?src-supplier=Farnell; ComponentLink1Description: https://datasheet.octopart.com/DA14531MOD-00F01002-Dialog-Semiconductor-datasheet-153441348.pdf?src-supplier=Farnell; ComponentLink2URL: https://datasheet.octopart.com/DA14531MOD-00F01002-Renesas-datasheet-169923465.pdf?src-supplier=Future+Electronics; ComponentLink2Description: https://datasheet.octopart.com/DA14531MOD-00F01002-Renesas-datasheet-169923465.pdf?src-supplier=Future+Electronics; Manufacturer Part Number: DA14531MOD-00F01002